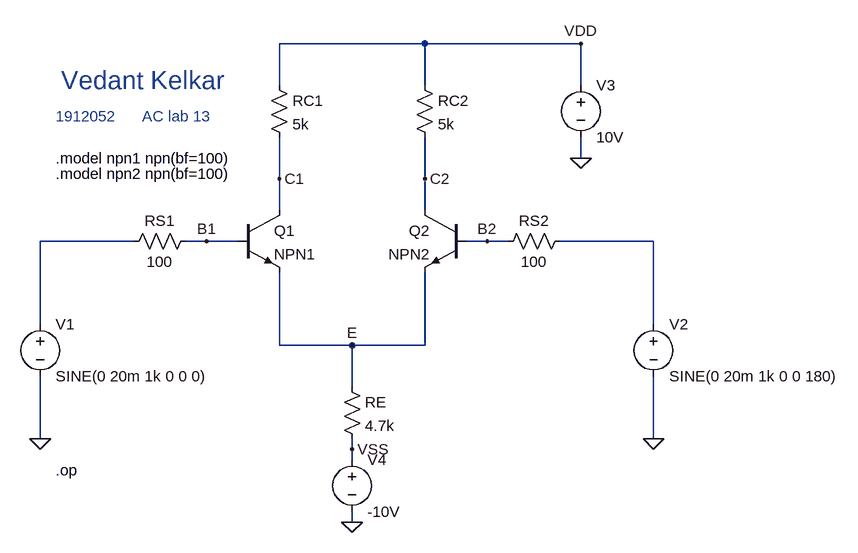
[diagram p0: schematic AC_Lab13a.asc]
AC_Lab13a.asc, the LTspice schematic file:
Version 4
SHEET 1 1248 680
WIRE 560 -256 336 -256
WIRE 800 -256 560 -256
WIRE 336 -192 336 -256
WIRE 560 -192 560 -256
WIRE 800 -192 800 -256
WIRE 800 -80 800 -112
WIRE 336 -48 336 -112
WIRE 560 -48 560 -112
WIRE 336 0 336 -48
WIRE 560 0 560 -48
WIRE 112 48 -32 48
WIRE 224 48 192 48
WIRE 272 48 224 48
WIRE 656 48 624 48
WIRE 688 48 656 48
WIRE 912 48 768 48
WIRE -32 176 -32 48
WIRE 912 176 912 48
WIRE 336 208 336 96
WIRE 448 208 336 208
WIRE 560 208 560 96
WIRE 560 208 448 208
WIRE 448 272 448 208
WIRE -32 352 -32 256
WIRE 912 352 912 256
WIRE 448 368 448 352
WIRE 448 384 448 368
WIRE 448 480 448 464
FLAG -32 352 0
FLAG 224 48 B1
FLAG 336 -48 C1
FLAG 912 352 0
FLAG 656 48 B2
FLAG 560 -48 C2
FLAG 448 208 E
FLAG 800 -80 0
FLAG 448 480 0
FLAG 800 -256 VDD
FLAG 448 368 VSS
SYMBOL voltage -32 160 R0
WINDOW 123 0 0 Left 0
WINDOW 39 0 0 Left 0
SYMATTR InstName V1
SYMATTR Value SINE(0 20m 1k 0 0 0)
SYMBOL res 208 32 R90
WINDOW 0 0 56 VBottom 2
WINDOW 3 32 56 VTop 2
SYMATTR InstName RS1
SYMATTR Value 100
SYMBOL npn 272 0 R0
SYMATTR InstName Q1
SYMATTR Value NPN1
SYMBOL res 320 -208 R0
SYMATTR InstName RC1
SYMATTR Value 5k
SYMBOL voltage 912 160 R0
WINDOW 123 0 0 Left 0
WINDOW 39 0 0 Left 0
SYMATTR InstName V2
SYMATTR Value SINE(0 20m 1k 0 0 180)
SYMBOL res 784 32 R90
WINDOW 0 0 56 VBottom 2
WINDOW 3 32 56 VTop 2
SYMATTR InstName RS2
SYMATTR Value 100
SYMBOL npn 624 0 M0
SYMATTR InstName Q2
SYMATTR Value NPN2
SYMBOL res 544 -208 R0
SYMATTR InstName RC2
SYMATTR Value 5k
SYMBOL res 432 256 R0
SYMATTR InstName RE
SYMATTR Value 4.7k
SYMBOL voltage 800 -208 R0
WINDOW 123 0 0 Left 0
WINDOW 39 0 0 Left 0
SYMATTR InstName V3
SYMATTR Value 10V
SYMBOL voltage 448 368 R0
WINDOW 123 0 0 Left 0
WINDOW 39 0 0 Left 0
SYMATTR InstName V4
SYMATTR Value -10V
TEXT 0 -200 Left 4 ;Vedant Kelkar
TEXT -8 -144 Left 2 ;1912052      AC lab 13
TEXT -8 -80 Left 2 !.model npn1 npn(bf=100)
TEXT -8 400 Left 2 !.op
TEXT -8 -56 Left 2 !.model npn2 npn(bf=100)

The netlist it stands for:
* AC_Lab13a.asc
V1 N001 0 SINE(0 20m 1k 0 0 0)
RS1 B1 N001 100
Q1 C1 B1 E 0 NPN1
RC1 VDD C1 5k
V2 N002 0 SINE(0 20m 1k 0 0 180)
RS2 N002 B2 100
Q2 C2 B2 E 0 NPN2
RC2 VDD C2 5k
RE E VSS 4.7k
V3 VDD 0 10V
V4 VSS 0 -10V
.model NPN NPN
.model PNP PNP
.lib standard.bjt
* Vedant Kelkar
* 1912052      AC lab 13
.model npn1 npn(bf=100)
.op
.model npn2 npn(bf=100)
.backanno
.end